# Altium schematic sheet weatherstation.SchDoc: Weather Station
size A4; CheckedBy: rrodrigu; Author: Satxo; CompanyName: Satxo; Revision: 0v1; SheetNumber: 8; SheetTotal: 8; ProjectName: Basestation
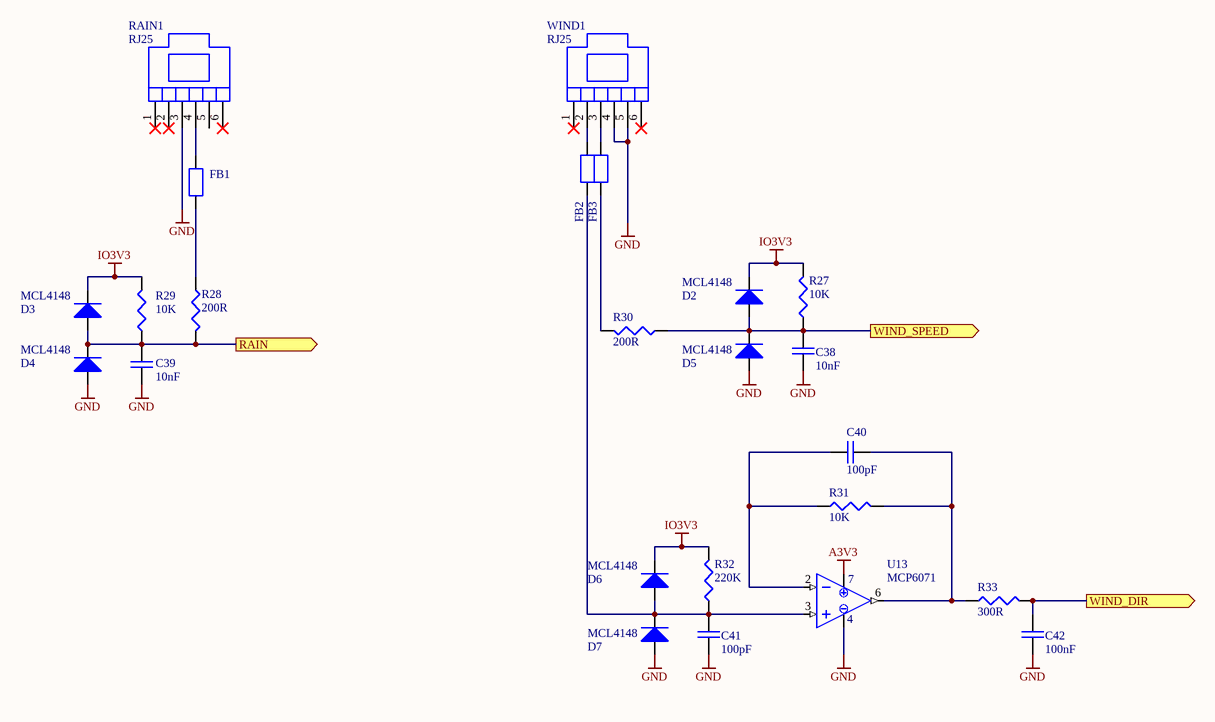
[diagram p0: weatherstation.SchDoc]

## Parts
C38  10nF  [0603]
C39  10nF  [0603]
C40  100pF  [0603]
C41  100pF  [0603]
C42  100nF  [0603]
D2  MCL4148  [0805@DIODE]
D3  MCL4148  [0805@DIODE]
D4  MCL4148  [0805@DIODE]
D5  MCL4148  [0805@DIODE]
D6  MCL4148  [0805@DIODE]
D7  MCL4148  [0805@DIODE]
FB1  150Z_100MHz  [0805]  (value not drawn)
FB2  150Z_100MHz  [0805]  (value not drawn)
FB3  150Z_100MHz  [0805]  (value not drawn)
R27  10K  [0603]
R28  200R  [0603]
R29  10K  [0603]
R30  200R  [0603]
R31  10K  [0603]
R32  220K  [0603]
R33  300R  [0603]
RAIN1  RJ25  [RJ25]
U13  MCP6071  [SOIC-8]
WIND1  RJ25  [RJ25]

## Ports
RAIN (out), WIND_DIR (out), WIND_SPEED (out)

## Nets
A3V3: U13.7(VDD)
GND: C38.1 C39.1 C41.1 C42.1 D4.A D5.A D7.A RAIN1.3 U13.4(VSS) WIND1.4 WIND1.5
IO3V3: D2.K D3.K D6.K R27.2 R29.2 R32.2
RAIN: C39.2 D3.A D4.K R28.2 R29.1 ; port RAIN
WIND_DIR: C42.2 R33.2 ; port WIND_DIR
WIND_SPEED: C38.2 D2.A D5.K R27.1 R30.1 ; port WIND_SPEED
NetC40_1: C40.1 R31.1 U13.2(INN)
NetC40_2: C40.2 R31.2 R33.1 U13.6(VOUT)
NetC41_2: C41.2 D6.A D7.K FB2.2 R32.1 U13.3(INP)
NetFB1_1: FB1.1 R28.1
NetFB1_2: FB1.2 RAIN1.4
NetFB2_1: FB2.1 WIND1.2
NetFB3_1: FB3.1 WIND1.3
NetFB3_2: FB3.2 R30.2

Not connected (* = marked no-connect by the designer): RAIN1 1* 2* 5 6*; WIND1 1* 6*

## Notes on the sheet
- Title
- Size:
- Date:
- A4
- Number:
- Time:
- Revision:
- Sheet
- of
- File:

## Library data of the parts
C38-C42 = CAP: Capacitor; Owner: Nuno Brum; Sub-Type: Ceramic; Assembly: INS; Maximum Voltage: *; Creation Date: 2005-04-28; Status: Valid; Validation date: 2006-05-15; Type: Capacitor
D2-D7 = Diode: Vishay Standard Avalanche Sinterglass Diode; Owner: Nuno Brum; Sub-Type: Generic; Assembly: INS; Validation date: 2006-05-15; Creation Date: 2001-06-05; Status: Valid; Model: MCL4148; Type: Diode
FB1-FB3 = FERRITE-BEAD-AXIAL: Ferrite bead; Sub-Type: Filter; Owner: Sergio Pires; Type: Electrical & Mechanical; Assembly: INS; Creation Date: 2005-10-20; Status: New
R27-R33 = RES: Resistor; Owner: Nuno Brum; Sub-Type: Generic; Assembly: INS; Validation date: 2006-05-15; Creation Date: 2002-07-17; Status: Valid; Power: *; Type: Resistor
RAIN1 WIND1 = RJ25: RJ25 Connector; Type: Connector; Creation Date: 2012-03-26
U13 = MCP6V26: Low-Offset Opamp; Type: IC; Creation Date: 2012-03-15